# Altium schematic sheet TopDesign.SchDoc
size A4; SheetNumber: 1; SheetTotal: 13
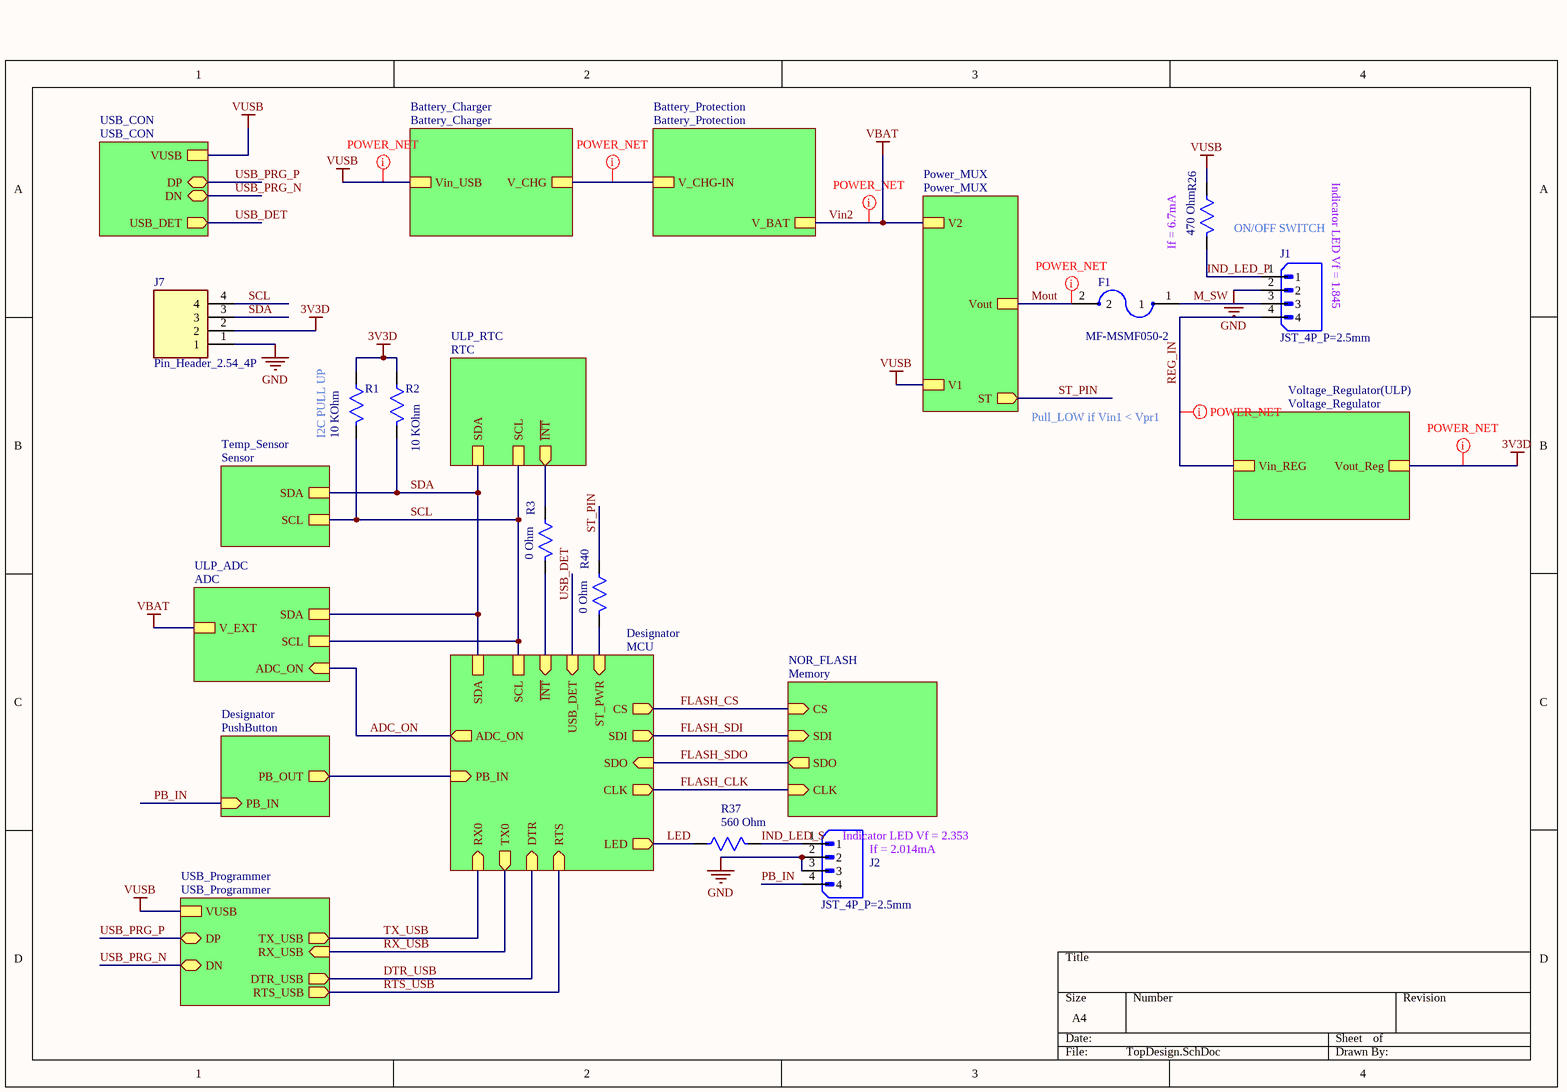
[diagram p0: TopDesign.SchDoc]

## Parts
F1  MF-MSMF050-2  [Fuse_SMD_1812_1A]
J1  JST_4P_P=2.5mm  [JST_4P_Straight_P=2.5mm]
J2  JST_4P_P=2.5mm  [JST_4P_Straight_P=2.5mm]
J7  Pin_Header_2.54_4P  [Pin_Header_2.54_4P]
R1  10 KOhm  [Res_0603]
R2  10 KOhm  [Res_0603]
R3  0 Ohm  [RES_0402]
R26  470 Ohm  [Res_0603]
R37  560 Ohm  [Res_0603]
R40  0 Ohm  [RES_0402]

## Sub-sheets
Battery_Charger = Battery_Charger: Vin_USB, V_CHG
Battery_Protection = Battery_Protection: V_BAT, V_CHG-IN
Designator = MCU: SDA, SCL, PB_IN (in), CS (out), SDI (out), SDO (in), CLK (out), USB_DET (in), ST_PWR (in), TX0 (out), RX0 (in), DTR (in), RTS (in), LED (out), ADC_ON (out), ~{INT} (in)
Designator = PushButton: PB_OUT (out), PB_IN (in)
NOR_FLASH = Memory: CS (in), SDI (in), SDO (out), CLK (in)
Power_MUX = Power_MUX: V2, V1, Vout, ST (out)
Temp_Sensor = Sensor: SDA, SCL
ULP_ADC = ADC: V_EXT, SDA, SCL, ADC_ON (in)
ULP_RTC = RTC: SDA, SCL, ~{INT} (out)
USB_CON = USB_CON: DP (bidir), DN (bidir), USB_DET (out), VUSB
USB_Programmer = USB_Programmer: TX_USB (out), RX_USB (in), DTR_USB (out), DP (bidir), DN (bidir), RTS_USB (out), VUSB
Voltage_Regulator(ULP) = Voltage_Regulator: Vin_REG, Vout_Reg

## Nets
3V3D: J7.2 R1.2 R2.2 ; sheet Voltage_Regulator(ULP)/Vout_Reg
GND: J1.2 J2.2 J2.3 J7.1
Vin2: sheet ULP_ADC/V_EXT, sheet Battery_Protection/V_BAT, sheet Power_MUX/V2  [also labelled VBAT]
VUSB: R26.2 ; sheet Battery_Charger/Vin_USB, sheet Power_MUX/V1, sheet USB_CON/VUSB, sheet USB_Programmer/VUSB
ADC_ON: sheet Designator/ADC_ON, sheet ULP_ADC/ADC_ON
DTR_USB: sheet Designator/DTR, sheet USB_Programmer/DTR_USB
FLASH_CLK: sheet Designator/CLK, sheet NOR_FLASH/CLK
FLASH_CS: sheet Designator/CS, sheet NOR_FLASH/CS
FLASH_SDI: sheet Designator/SDI, sheet NOR_FLASH/SDI
FLASH_SDO: sheet Designator/SDO, sheet NOR_FLASH/SDO
IND_LED_P: J1.1 R26.1
IND_LED_S: J2.1 R37.1
LED: R37.2 ; sheet Designator/LED
M_SW: F1.1 J1.3
Mout: F1.2 ; sheet Power_MUX/Vout
PB_IN: J2.4 ; sheet Designator/PB_IN
REG_IN: J1.4 ; sheet Voltage_Regulator(ULP)/Vin_REG
RTS_USB: sheet Designator/RTS, sheet USB_Programmer/RTS_USB
RX_USB: sheet Designator/TX0, sheet USB_Programmer/RX_USB
SCL: J7.4 R1.1 ; sheet Designator/SCL, sheet Temp_Sensor/SCL, sheet ULP_RTC/SCL, sheet ULP_ADC/SCL
SDA: J7.3 R2.1 ; sheet Designator/SDA, sheet Temp_Sensor/SDA, sheet ULP_RTC/SDA, sheet ULP_ADC/SDA
ST_PIN: R40.2 ; sheet Power_MUX/ST
TX_USB: sheet Designator/RX0, sheet USB_Programmer/TX_USB
USB_DET: sheet Designator/USB_DET, sheet USB_CON/USB_DET
USB_PRG_N: sheet USB_CON/DN, sheet USB_Programmer/DN
USB_PRG_P: sheet USB_CON/DP, sheet USB_Programmer/DP
NetR3_1: R3.1 ; sheet Designator/~{INT}
NetR3_2: R3.2 ; sheet ULP_RTC/~{INT}
NetR40_1: R40.1 ; sheet Designator/ST_PWR
(unnamed): sheet Designator/PB_IN, sheet Designator/PB_OUT
(unnamed): sheet Battery_Protection/V_CHG-IN, sheet Battery_Charger/V_CHG

## Layout directives
net class POWER_NET: 3V3D, (no net found under the mark), Mout, REG_IN, Vin2, VUSB

## Notes on the sheet
- ON/OFF SWITCH
- (near J1) Indicator LED Vf = 1.845
- (near R26) If = 6.7mA
- (near R1) I2C PULL UP
- Pull_LOW if Vin1 < Vpr1
- (near J2) Indicator LED Vf = 2.353
- (near J2) If = 2.014mA

## Library data of the parts
F1 = MF-MSMF050-2: Polymeric PTC Resettable Fuse 15V 500 mA Ih Surface Mount 1812 (4532 Metric), Concave; MF: Bourns; MP: MF-MSMF050-2; Availability: In Stock; Check_prices: https://www.snapeda.com/parts/MF-MSMF050-2/Bourns+-+J.W.+Miller/view-part/?ref=eda; Price: None; Package: 1812 Bourns; Purchase-URL: https://pricing.snapeda.com/search/part/MF-MSMF050-2/?ref=eda; Value: *; SnapEDA_Link: https://www.snapeda.com/parts/MF-MSMF050-2/Bourns+-+J.W.+Miller/view-part/?ref=snap
J1 J2 = JST_4P_P=2.5mm: Connector Header Through Hole 4 position 0.098 (2.50mm); MF: JST Sales; MP: B4B-XH-A(LF)(SN); SnapEDA_Link: https://www.snapeda.com/parts/B4B-XH-A(LF)(SN)/JST+Sales+America+Inc./view-part/?ref=snap; Package: None; Value: *; Check_prices: https://www.snapeda.com/parts/B4B-XH-A(LF)(SN)/JST+Sales+America+Inc./view-part/?ref=eda
J7 = Pin_Header_2.54_4P: Pin_Header_2.54_2P X 4 MF: 22-28-4050; Manufacturer_Name: Molex; Datasheet Link: http://www.mouser.com/ds/2/276/0022284050_PCB_HEADERS-228092.pdf; Height: 8.38mm; Manufacturer_Part_Number: 22-28-4050; Mouser Part Number: 538-22-28-4050; Mouser Price/Stock: https://www.mouser.co.uk/ProductDetail/Molex/22-28-4050?qs=MuwpYaHj752E1%2FBLq%2Fipmg%3D%3D
R1-R3 R26 R37 R40 = Res smd: SMD Resistor; MP: RC0805FR-07330RL; MF: Yageo; Package: 2012 Rohm Semiconductor; Value: *; SnapEDA_Link: https://www.snapeda.com/parts/RC0805FR-07330RL/Yageo/view-part/106115/?ref=snap; Price: None; Availability: Unavailable